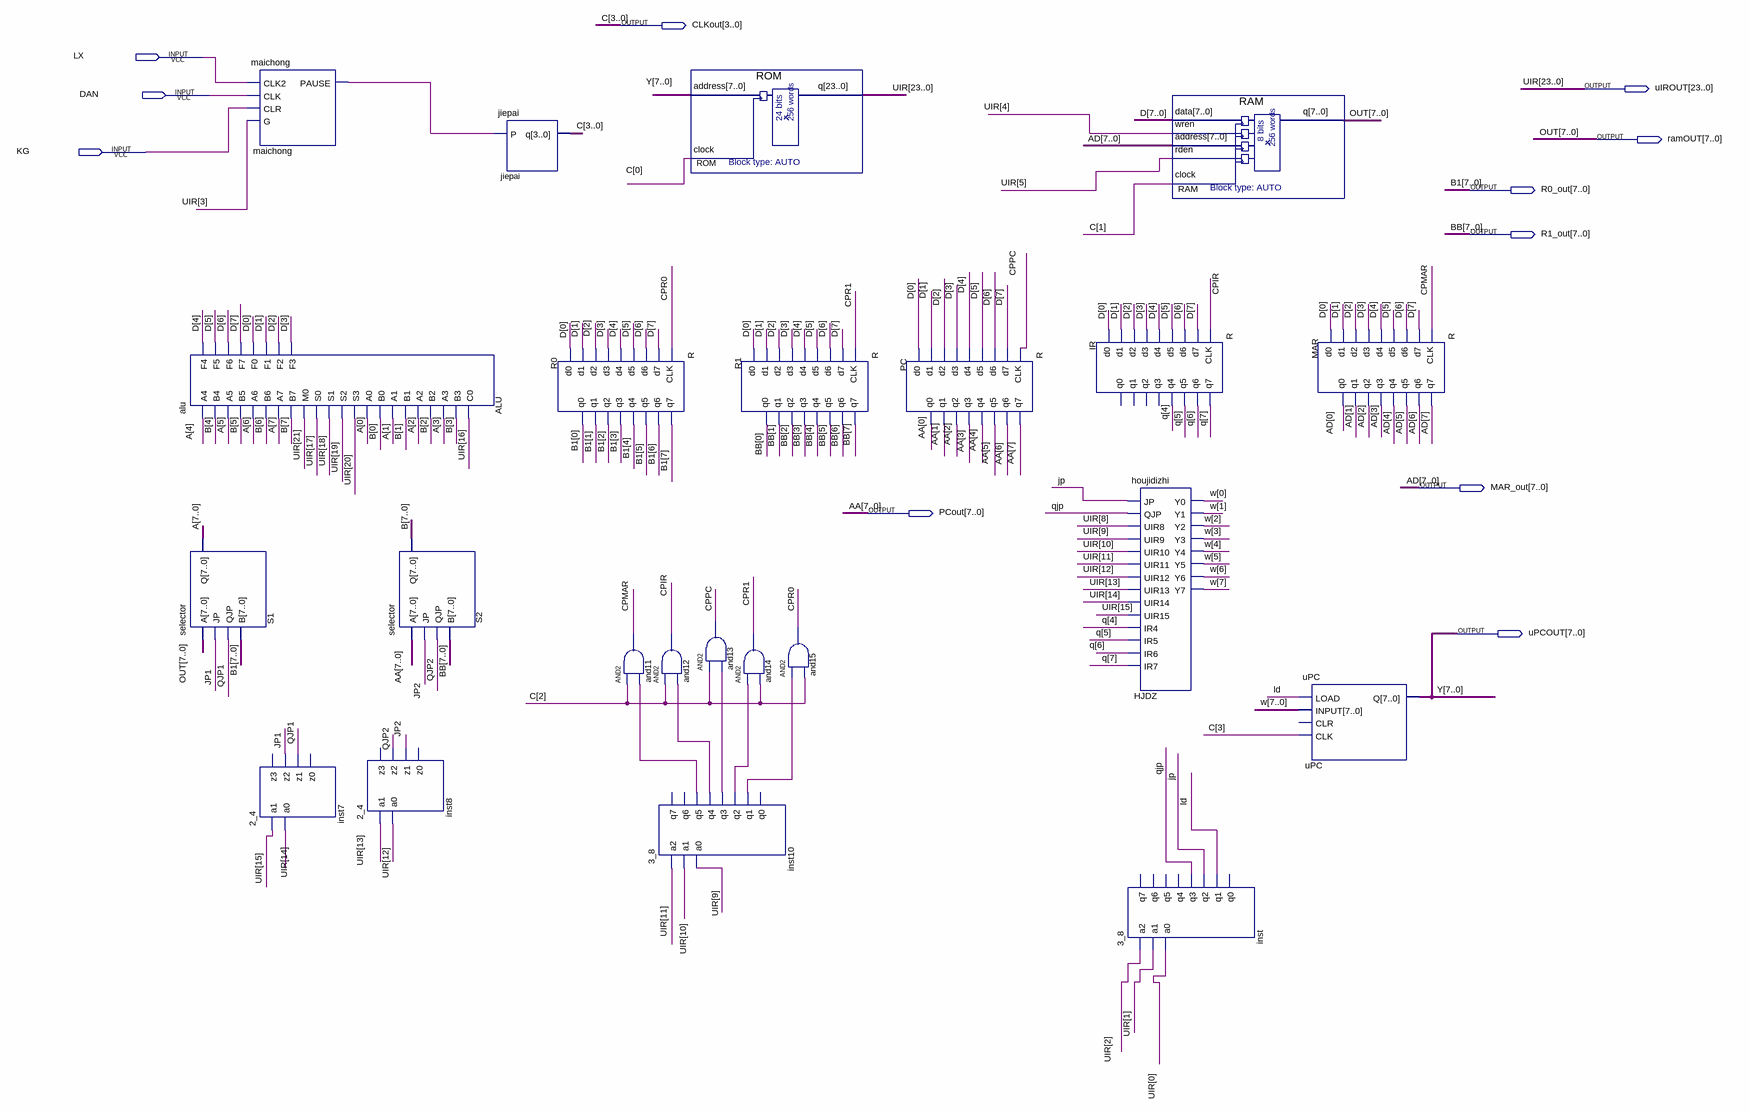
[diagram p0: schematic sheet]
// Quartus schematic lab3.bdf as structural Verilog: 23 symbols, 11 pins
module lab3 (
  input  LX,
  input  DAN,
  input  KG,
  output [3:0] CLKout,
  output [23:0] uIROUT,
  output [7:0] ramOUT,
  output [7:0] R0_out,
  output [7:0] R1_out,
  output [7:0] MAR_out,
  output [7:0] PCout,
  output [7:0] uPCOUT
);

  wire CPIR, CPMAR, CPPC, CPR0, CPR1, inst10_q1, inst10_q2, inst10_q3, inst10_q4, inst10_q5, jp, JP1, JP2,
       ld, maichong_pause, qjp, QJP1, QJP2;
  wire [7:0] A, B, D, w;
  wire [7:4] q;

  alu ALU (
    .A4(A[4]), .B4(B[4]), .A5(A[5]), .B5(B[5]), .A6(A[6]), .B6(B[6]), .A7(A[7]), .B7(B[7]), .M0(uIROUT[21]),
    .S0(uIROUT[17]), .S1(uIROUT[18]), .S2(uIROUT[19]), .S3(uIROUT[20]), .A0(A[0]), .B0(B[0]), .A1(A[1]),
    .B1(B[1]), .A2(A[2]), .B2(B[2]), .A3(A[3]), .B3(B[3]), .C0(uIROUT[16]), .F4(D[4]), .F5(D[5]), .F6(D[6]),
    .F7(D[7]), .F0(D[0]), .F1(D[1]), .F2(D[2]), .F3(D[3]));
  selector S1 (.A(ramOUT), .JP(JP1), .QJP(QJP1), .B(R0_out), .Q(A));
  maichong maichong (.CLK2(LX), .CLK(DAN), .CLR(KG), .G(uIROUT[3]), .PAUSE(maichong_pause));
  \2_4  inst7 (.a1(uIROUT[15]), .a0(uIROUT[14]), .z2(JP1), .z1(QJP1));  // open: z3, z0
  \2_4  inst8 (.a1(uIROUT[13]), .a0(uIROUT[12]), .z2(QJP2), .z1(JP2));  // open: z3, z0
  selector S2 (.A(PCout), .JP(JP2), .QJP(QJP2), .B(R1_out), .Q(B));
  jiepai jiepai (.P(maichong_pause), .q(CLKout));
  R R0 (
    .CLK(CPR0), .d7(D[7]), .d6(D[6]), .d5(D[5]), .d4(D[4]), .d3(D[3]), .d2(D[2]), .d1(D[1]), .d0(D[0]),
    .q7(R0_out[7]), .q6(R0_out[6]), .q5(R0_out[5]), .q4(R0_out[4]), .q3(R0_out[3]), .q2(R0_out[2]),
    .q1(R0_out[1]), .q0(R0_out[0]));
  and and11 (CPMAR, CLKout[2], inst10_q5);
  and and12 (CPIR, CLKout[2], inst10_q4);
  \3_8  inst10 (
    .a2(uIROUT[11]), .a1(uIROUT[10]), .a0(uIROUT[9]), .q5(inst10_q5), .q4(inst10_q4), .q3(inst10_q3),
    .q2(inst10_q2), .q1(inst10_q1));  // open: q7, q6, q0
  ROM ROM (.address(uPCOUT), .clock(CLKout[0]), .q(uIROUT));
  and and13 (CPPC, CLKout[2], inst10_q3);
  R R1 (
    .CLK(CPR1), .d7(D[7]), .d6(D[6]), .d5(D[5]), .d4(D[4]), .d3(D[3]), .d2(D[2]), .d1(D[1]), .d0(D[0]),
    .q7(R1_out[7]), .q6(R1_out[6]), .q5(R1_out[5]), .q4(R1_out[4]), .q3(R1_out[3]), .q2(R1_out[2]),
    .q1(R1_out[1]), .q0(R1_out[0]));
  and and14 (CPR1, inst10_q2, CLKout[2]);
  and and15 (CPR0, inst10_q1, CLKout[2]);
  R PC (
    .CLK(CPPC), .d7(D[7]), .d6(D[6]), .d5(D[5]), .d4(D[4]), .d3(D[3]), .d2(D[2]), .d1(D[1]), .d0(D[0]),
    .q7(PCout[7]), .q6(PCout[6]), .q5(PCout[5]), .q4(PCout[4]), .q3(PCout[3]), .q2(PCout[2]), .q1(PCout[1]),
    .q0(PCout[0]));
  R IR (
    .CLK(CPIR), .d7(D[7]), .d6(D[6]), .d5(D[5]), .d4(D[4]), .d3(D[3]), .d2(D[2]), .d1(D[1]), .d0(D[0]),
    .q7(q[7]), .q6(q[6]), .q5(q[5]), .q4(q[4]));  // open: q3, q2, q1, q0
  \3_8  inst (.a2(uIROUT[2]), .a1(uIROUT[1]), .a0(uIROUT[0]), .q3(qjp), .q2(jp), .q1(ld));  // open: q7, q6, q5, q4, q0
  houjidizhi HJDZ (
    .JP(jp), .QJP(qjp), .UIR8(uIROUT[8]), .UIR9(uIROUT[9]), .UIR10(uIROUT[10]), .UIR11(uIROUT[11]),
    .UIR12(uIROUT[12]), .UIR13(uIROUT[13]), .UIR14(uIROUT[14]), .UIR15(uIROUT[15]), .IR4(q[4]), .IR5(q[5]),
    .IR6(q[6]), .IR7(q[7]), .Y0(w[0]), .Y1(w[1]), .Y2(w[2]), .Y3(w[3]), .Y4(w[4]), .Y5(w[5]), .Y6(w[6]),
    .Y7(w[7]));
  RAM RAM (.data(D), .wren(uIROUT[4]), .address(MAR_out), .rden(uIROUT[5]), .clock(CLKout[1]), .q(ramOUT));
  R MAR (
    .CLK(CPMAR), .d7(D[7]), .d6(D[6]), .d5(D[5]), .d4(D[4]), .d3(D[3]), .d2(D[2]), .d1(D[1]), .d0(D[0]),
    .q7(MAR_out[7]), .q6(MAR_out[6]), .q5(MAR_out[5]), .q4(MAR_out[4]), .q3(MAR_out[3]), .q2(MAR_out[2]),
    .q1(MAR_out[1]), .q0(MAR_out[0]));
  uPC uPC (.LOAD(ld), .INPUT(w), .CLK(CLKout[3]), .Q(uPCOUT));  // open: CLR

  // Other names for the same wires on the sheet: AA[7:0] = PCout; AD[7:0] = MAR_out; B1[7:0] = R0_out;
  //   BB[7:0] = R1_out; C[3:0] = CLKout; OUT[7:0] = ramOUT; UIR[23:0] = uIROUT; Y[7:0] = uPCOUT
endmodule
